# EAGLE design Estrella Neopixel PCBA (EAGLE 9.4.2)
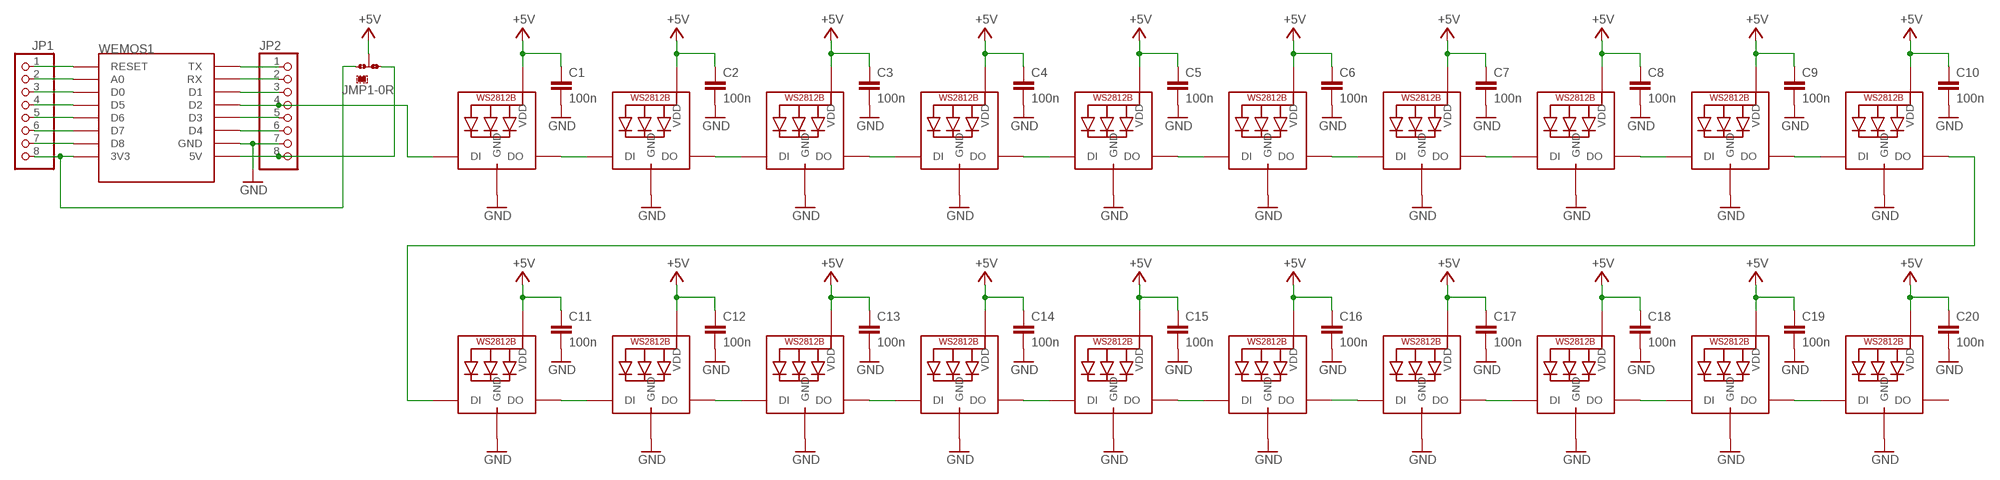
[diagram p0: schematic, sheet 1]

## Parts
C1  100n  C-EUC0805K  [C0805K]
C2  100n  C-EUC0805K  [C0805K]
C3  100n  C-EUC0805K  [C0805K]
C4  100n  C-EUC0805K  [C0805K]
C5  100n  C-EUC0805K  [C0805K]
C6  100n  C-EUC0805K  [C0805K]
C7  100n  C-EUC0805K  [C0805K]
C8  100n  C-EUC0805K  [C0805K]
C9  100n  C-EUC0805K  [C0805K]
C10  100n  C-EUC0805K  [C0805K]
C11  100n  C-EUC0805K  [C0805K]
C12  100n  C-EUC0805K  [C0805K]
C13  100n  C-EUC0805K  [C0805K]
C14  100n  C-EUC0805K  [C0805K]
C15  100n  C-EUC0805K  [C0805K]
C16  100n  C-EUC0805K  [C0805K]
C17  100n  C-EUC0805K  [C0805K]
C18  100n  C-EUC0805K  [C0805K]
C19  100n  C-EUC0805K  [C0805K]
C20  100n  C-EUC0805K  [C0805K]
JMP1  0R-JUMPA  [A0R-JMP]
JP1  PINHD-1X8  [1X08]
JP2  PINHD-1X8  [1X08]
LED1  WS2812B_5050N  [WS2812B-NARROW]
LED2  WS2812B_5050N  [WS2812B-NARROW]
LED3  WS2812B_5050N  [WS2812B-NARROW]
LED4  WS2812B_5050N  [WS2812B-NARROW]
LED5  WS2812B_5050N  [WS2812B-NARROW]
LED6  WS2812B_5050N  [WS2812B-NARROW]
LED7  WS2812B_5050N  [WS2812B-NARROW]
LED8  WS2812B_5050N  [WS2812B-NARROW]
LED9  WS2812B_5050N  [WS2812B-NARROW]
LED10  WS2812B_5050N  [WS2812B-NARROW]
LED11  WS2812B_5050N  [WS2812B-NARROW]
LED12  WS2812B_5050N  [WS2812B-NARROW]
LED13  WS2812B_5050N  [WS2812B-NARROW]
LED14  WS2812B_5050N  [WS2812B-NARROW]
LED15  WS2812B_5050N  [WS2812B-NARROW]
LED16  WS2812B_5050N  [WS2812B-NARROW]
LED17  WS2812B_5050N  [WS2812B-NARROW]
LED18  WS2812B_5050N  [WS2812B-NARROW]
LED19  WS2812B_5050N  [WS2812B-NARROW]
LED20  WS2812B_5050N  [WS2812B-NARROW]
WEMOS1  WEMOS-D1-MINI  [WEMOS-D1-MINI]

## Nets
+5V: C1.1 C2.1 C3.1 C4.1 C5.1 C6.1 C7.1 C8.1 C9.1 C10.1 C11.1 C12.1 C13.1 C14.1 C15.1 C16.1 C17.1 C18.1 C19.1 C20.1 JMP1.2 LED1.1-VDD(VDD) LED2.1-VDD(VDD) LED3.1-VDD(VDD) LED4.1-VDD(VDD) LED5.1-VDD(VDD) LED6.1-VDD(VDD) LED7.1-VDD(VDD) LED8.1-VDD(VDD) LED9.1-VDD(VDD) LED10.1-VDD(VDD) LED11.1-VDD(VDD) LED12.1-VDD(VDD) LED13.1-VDD(VDD) LED14.1-VDD(VDD) LED15.1-VDD(VDD) LED16.1-VDD(VDD) LED17.1-VDD(VDD) LED18.1-VDD(VDD) LED19.1-VDD(VDD) LED20.1-VDD(VDD)
GND: C1.2 C2.2 C3.2 C4.2 C5.2 C6.2 C7.2 C8.2 C9.2 C10.2 C11.2 C12.2 C13.2 C14.2 C15.2 C16.2 C17.2 C18.2 C19.2 C20.2 JP2.7 LED1.3-GND(GND) LED2.3-GND(GND) LED3.3-GND(GND) LED4.3-GND(GND) LED5.3-GND(GND) LED6.3-GND(GND) LED7.3-GND(GND) LED8.3-GND(GND) LED9.3-GND(GND) LED10.3-GND(GND) LED11.3-GND(GND) LED12.3-GND(GND) LED13.3-GND(GND) LED14.3-GND(GND) LED15.3-GND(GND) LED16.3-GND(GND) LED17.3-GND(GND) LED18.3-GND(GND) LED19.3-GND(GND) LED20.3-GND(GND) WEMOS1.GND
N$1: LED1.2-DOUT(DO) LED2.4-DIN(DI)
N$2: LED2.2-DOUT(DO) LED3.4-DIN(DI)
N$3: LED3.2-DOUT(DO) LED4.4-DIN(DI)
N$4: LED4.2-DOUT(DO) LED5.4-DIN(DI)
N$5: LED5.2-DOUT(DO) LED6.4-DIN(DI)
N$6: LED6.2-DOUT(DO) LED7.4-DIN(DI)
N$7: LED7.2-DOUT(DO) LED8.4-DIN(DI)
N$8: LED8.2-DOUT(DO) LED9.4-DIN(DI)
N$9: LED9.2-DOUT(DO) LED10.4-DIN(DI)
N$10: LED10.2-DOUT(DO) LED11.4-DIN(DI)
N$11: LED11.2-DOUT(DO) LED12.4-DIN(DI)
N$12: LED12.2-DOUT(DO) LED13.4-DIN(DI)
N$13: LED13.2-DOUT(DO) LED14.4-DIN(DI)
N$14: LED14.2-DOUT(DO) LED15.4-DIN(DI)
N$15: LED15.2-DOUT(DO) LED16.4-DIN(DI)
N$16: JMP1.3 JP2.8 WEMOS1.5V
N$17: JMP1.1 JP1.8 WEMOS1.3V3
N$18: JP1.1 WEMOS1.RESET
N$19: JP1.2 WEMOS1.A0
N$20: JP1.3 WEMOS1.D0
N$21: JP1.4 WEMOS1.D5
N$22: JP1.5 WEMOS1.D6
N$23: JP1.6 WEMOS1.D7
N$24: JP1.7 WEMOS1.D8
N$25: JP2.6 WEMOS1.D4
N$26: JP2.5 WEMOS1.D3
N$27: JP2.3 WEMOS1.D1
N$28: JP2.2 WEMOS1.RX
N$29: JP2.1 WEMOS1.TX
N$30: JP2.4 LED1.4-DIN(DI) WEMOS1.D2
N$31: LED17.2-DOUT(DO) LED18.4-DIN(DI)
N$32: LED18.2-DOUT(DO) LED19.4-DIN(DI)
N$33: LED19.2-DOUT(DO) LED20.4-DIN(DI)
N$34: LED16.2-DOUT(DO) LED17.4-DIN(DI)
Unconnected: LED20.2-DOUT(DO)

## Library data of the parts
C1-C20 = rcl:C-EU: CAPACITOR, European symbol; SPICEPREFIX: C
JMP1 = jump-0r-smd:0R-JUMP: SMD 0R 0805 Jumper
JP1 JP2 = pinhead:PINHD-1X8: PIN HEADER
LED1-LED20 = adafruit:WS2812B
WEMOS1 = esp8266modules:WEMOS-D1-MINI: WeMos.cc D1 mini ESP8266 module

## Board
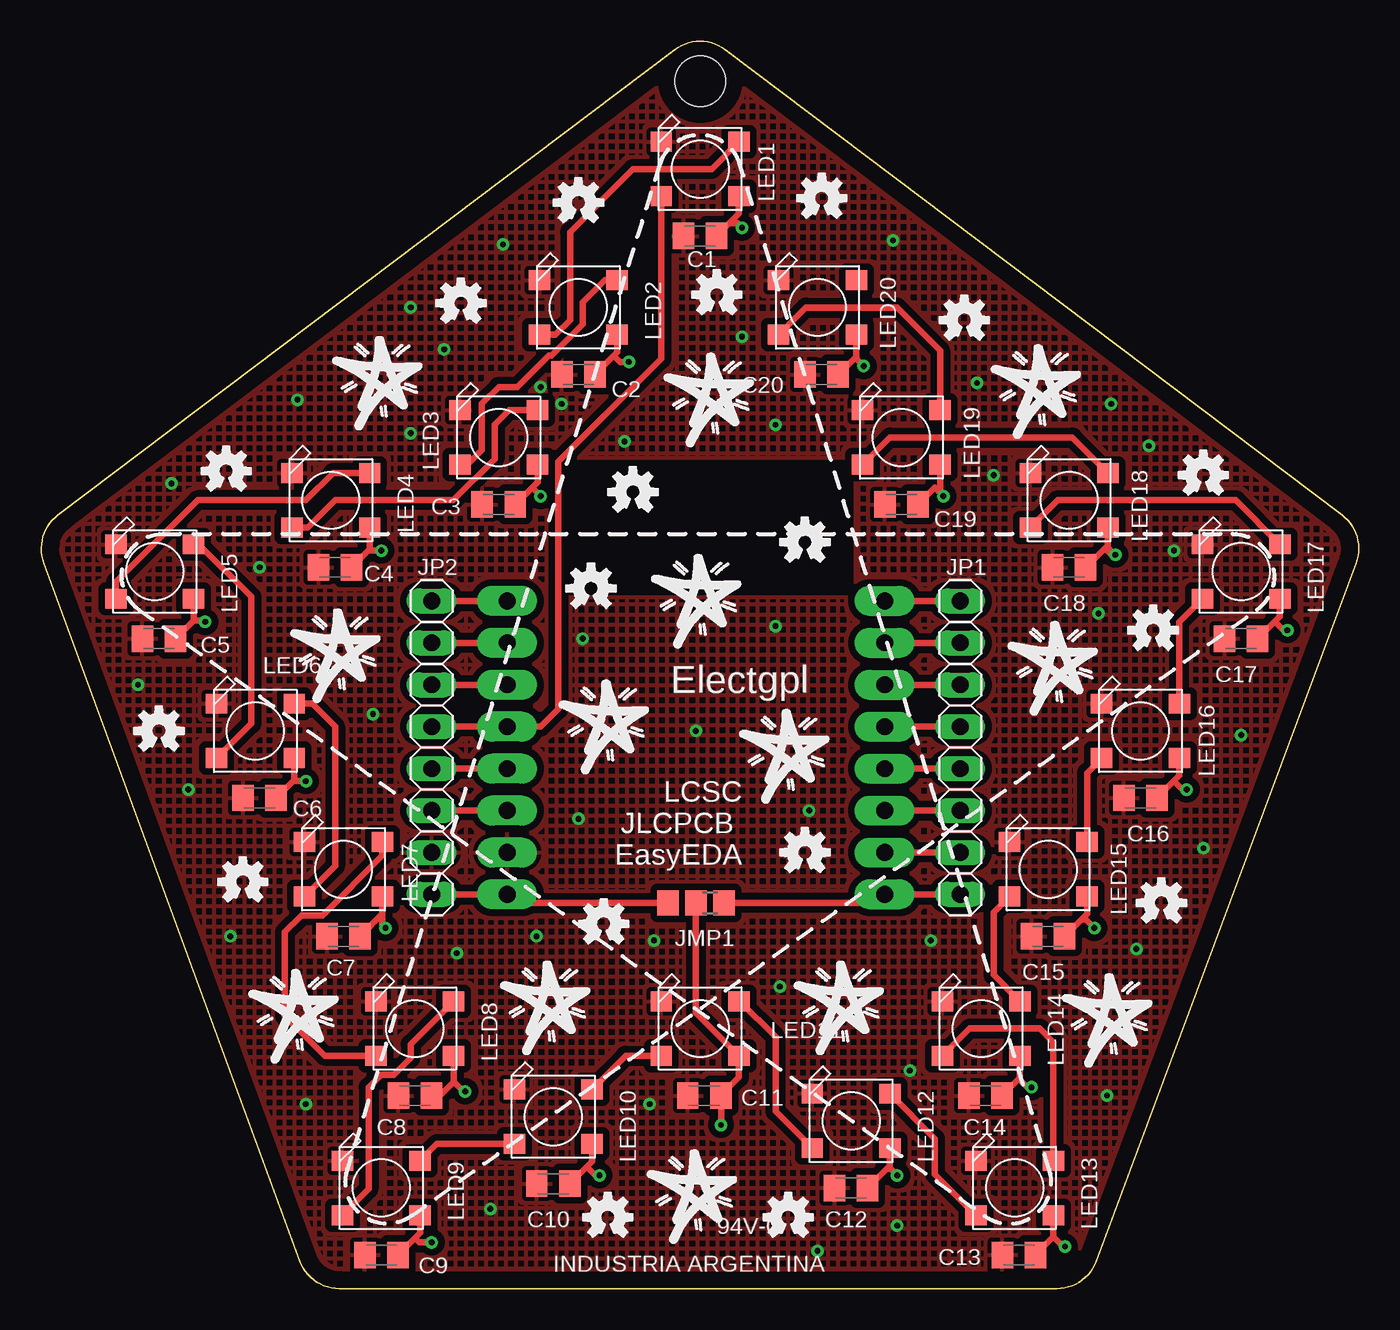
[diagram p1: board, top side]
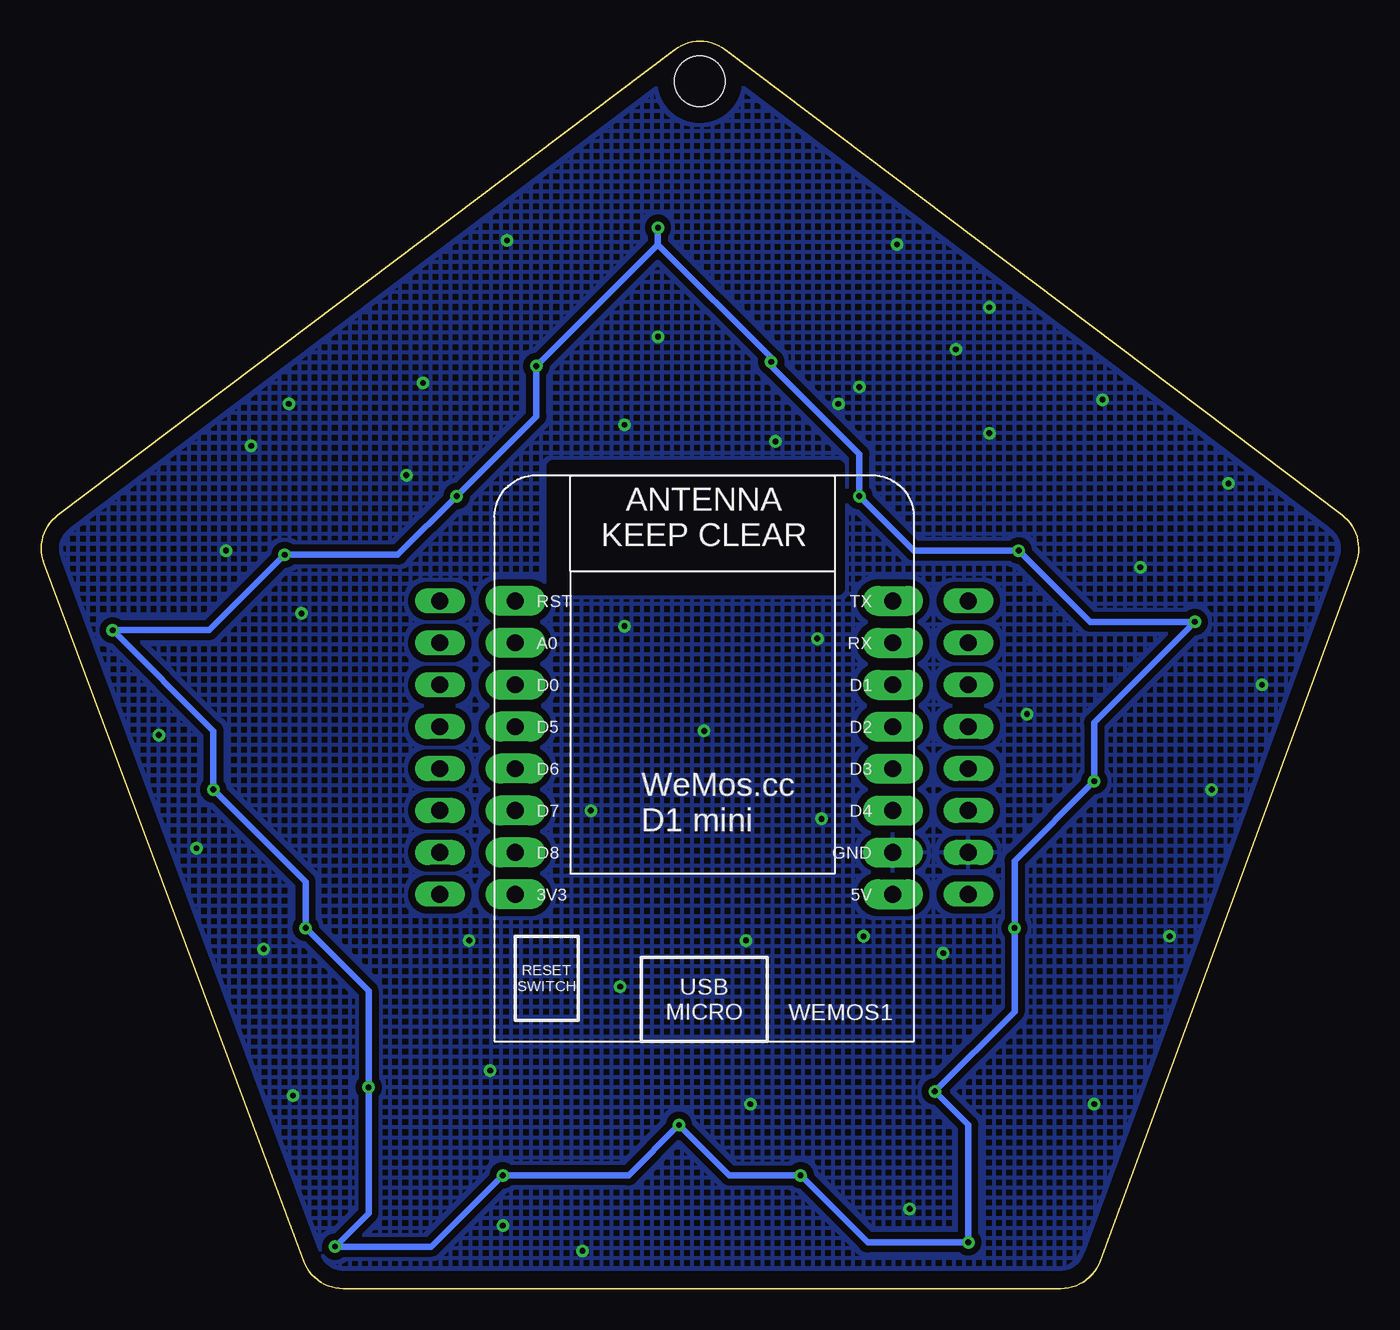
[diagram p2: board, bottom side, seen from below]

Size 79.78 x 75.56 mm. Coordinates in mm from the lower left corner, seen from the top.
Outline: 0.15,43.95 15.66,1.67 arc70 18.04,0 61.5,0 arc70 63.88,1.65 79.62,43.95 arc73 78.77,46.86 41.42,75.05 arc74 38.36,75.05 1.01,46.85 arc73 0.15,43.95
Copper layers (1*16): Top 0.035mm / dielectric 1.5mm / Bottom 0.035mm
Design rules "default": minimum track width 6mil, minimum drill 0.35mm, track to track 6mil, track to pad 6mil, pad to pad 6mil, via to via 6mil, smd to smd 6mil, copper to edge 40mil, drill to drill 6mil, minimum pad ring 10mil, minimum via ring 8mil, stop-mask expansion 4mil, vias tented up to drill 0mil, thermal gap 10mil
Holes 3.05 mm at 39.89,73.15
tRestrict: area 31.5,42.4 to 48.8,49.8
bRestrict: area 31.5,42.4 to 48.8,49.8

### Footprints (pad centres in the part's own frame; a part is rotated, then mirrored left to right if it is on the bottom)
C0805K = smd 1.3 x 1.6: 1 -1,0; 2 1,0
A0R-JMP = smd 1.5 x 1.3: 1 0,1.7; 2 0,0; 3 0,-1.7
1X08 = drill 1.016 long: 1 -8.89,0; 2 -6.35,0; 3 -3.81,0; 4 -1.27,0; 5 1.27,0; 6 3.81,0; 7 6.35,0; 8 8.89,0
WS2812B-NARROW = smd 1.3 x 1.2: 1-VDD 2.35,-1.65; 2-DOUT 2.35,1.65; 3-GND -2.35,1.65; 4-DIN -2.35,-1.65
WEMOS-D1-MINI = drill 1.016 pad 1.829 long: 3V3 -10.16,-10.16; 5V 12.7,-10.16; A0 -10.16,5.08; D0 -10.16,2.54; D1 12.7,2.54; D2 12.7,0; D3 12.7,-2.54; D4 12.7,-5.08; D5 -10.16,0; D6 -10.16,-2.54; D7 -10.16,-5.08; D8 -10.16,-7.62; GND 12.7,-7.62; RESET -10.16,7.62; RX 12.7,5.08; TX 12.7,7.62

### Placement (x,y rotation side)
C1  39.89,63.75 180 top
C2  32.53,55.37 180 top
C3  27.7,47.5 180 top
C4  17.79,43.69 180 top
C5  7.13,39.37 180 top
C6  13.22,29.72 180 top
C7  18.3,21.34 180 top
C8  22.62,11.68 180 top
C9  20.59,2.03 180 top
C10  31,6.35 180 top
C11  40.15,11.68 180 top
C12  49.04,6.1 180 top
C13  59.2,2.03 180 top
C14  57.16,11.68 180 top
C15  60.97,21.34 180 top
C16  66.56,29.72 180 top
C17  72.66,39.37 180 top
C18  62.24,43.69 180 top
C19  52.08,47.5 180 top
C20  47.26,55.37 180 top
JMP1  39.64,23.37 270 top
JP1  55.64,32.77 270 top
JP2  23.64,32.77 270 top
LED1  39.89,67.82 0 top
LED2  32.53,59.44 0 top
LED3  27.7,51.56 0 top
LED4  17.54,47.75 0 top
LED5  6.87,43.43 0 top
LED6  12.97,33.78 0 top
LED7  18.3,25.4 0 top
LED8  22.62,15.75 0 top
LED9  20.59,6.1 0 top
LED10  31,10.41 0 top
LED11  39.89,15.75 0 top
LED12  49.04,10.16 0 top
LED13  58.94,6.1 0 top
LED14  56.91,15.75 0 top
LED15  60.97,25.4 0 top
LED16  66.56,33.78 0 top
LED17  72.66,43.43 0 top
LED18  62.24,47.75 0 top
LED19  52.08,51.56 0 top
LED20  47,59.44 0 top
U$1  [STARBOARD_LOGO]  20.33,54.86 0 top
U$2  [STARBOARD_LOGO]  60.21,54.36 0 top
U$3  [STARBOARD_LOGO]  64.53,16.26 0 top
U$4  [STARBOARD_LOGO]  40.4,53.85 0 top
U$5  [STARBOARD_LOGO]  15.25,16.51 0 top
U$6  [STARBOARD_LOGO]  39.38,5.59 0 top
U$7  [STARBOARD_LOGO]  30.49,17.02 0 top
U$8  [STARBOARD_LOGO]  48.27,17.02 0 top
U$9  [STARBOARD_LOGO]  17.79,38.35 0 top
U$10  [STARBOARD_LOGO]  61.23,37.59 0 top
U$11  [OSHW-LOGO-S]  12.21,24.64 0 top
U$12  [OSHW-LOGO-S]  34.05,22.1 0 top
U$13  [STARBOARD_LOGO]  34.05,34.04 0 top
U$14  [STARBOARD_LOGO]  44.97,32.26 0 top
U$15  [STARBOARD_LOGO]  39.64,41.66 0 top
U$16  [OSHW-LOGO-S]  46.24,26.42 0 top
U$17  [OSHW-LOGO-S]  7.13,33.78 0 top
U$18  [OSHW-LOGO-S]  11.19,49.53 0 top
U$19  [OSHW-LOGO-S]  46.24,45.21 0 top
U$20  [OSHW-LOGO-S]  33.29,42.42 0 top
U$21  [OSHW-LOGO-S]  67.83,23.37 0 top
U$22  [OSHW-LOGO-S]  45.23,4.32 0 top
U$23  [OSHW-LOGO-S]  34.3,4.32 0 top
U$24  [OSHW-LOGO-S]  25.41,59.69 0 top
U$25  [OSHW-LOGO-S]  70.37,49.28 0 top
U$26  [OSHW-LOGO-S]  47.26,66.04 0 top
U$27  [OSHW-LOGO-S]  55.89,58.67 0 top
U$28  [OSHW-LOGO-S]  32.53,65.79 0 top
U$29  [OSHW-LOGO-S]  40.91,60.2 0 top
U$30  [OSHW-LOGO-S]  35.83,48.26 0 top
U$31  [OSHW-LOGO-S]  67.32,39.88 0 top
WEMOS1  40.91,34.04 0 bottom

### Tracks (layer width: path | path; a pad name or v marks a point on that pad's centre or on a via)
+5V  (via drill 0.35)
  Top 0.406: LED5.1-VDD 9.22,40.47 | C5.1 9.22,40.47 | LED6.1-VDD 15.32,30.81 | 15.32,30.81 C6.1 | LED3.1-VDD 30.05,48.85 29.72,48.52 | 29.72,48.52 C3.1 | LED2.1-VDD 34.88,56.72 34.68,56.52 | 34.68,56.52 C2.1 | LED20.1-VDD 49.35,56.47 | 49.35,56.47 C20.1 | C19.1 54.11,48.52 v54.62,48.01 54.43,48.2 LED19.1-VDD | C18.1 64.4,44.84 64.78,44.45 v65.04,44.45 64.59,44.89 LED18.1-VDD | LED17.1-VDD 75.01,40.72 74.68,40.39 | 74.68,40.39 C17.1 | LED16.1-VDD 68.91,31.07 68.59,30.74 | 68.59,30.74 C16.1 | LED15.1-VDD 63.32,22.69 63,22.36 | 63,22.36 C15.1 | LED14.1-VDD 59.26,12.78 59.19,12.71 | 59.19,12.71 C14.1 | LED13.1-VDD 61.29,3.13 | 61.29,3.13 C13.1 | LED12.1-VDD 51.39,7.45 51.19,7.25 | 51.19,7.25 C12.1 | LED10.1-VDD 33.35,7.7 33.03,7.37 | 33.03,7.37 C10.1 | LED9.1-VDD 22.94,3.38 22.61,3.06 | 22.61,3.06 C9.1 | LED8.1-VDD 24.97,12.51 | 24.97,12.51 23.64,11.18 23.62,11.19 C8.1 | C7.1 20.65,22.69 LED7.1-VDD 20.65,22.03 v20.84,21.84 | v25.67,11.94 25.54,11.94 24.97,12.51 | 22.61,3.06 22.87,2.79 v23.64,2.79 | v33.8,6.86 33.54,6.86 33.03,7.37 | v41.16,9.91 41.16,11.67 C11.1 42.24,12.78 LED11.1-VDD 39.64,16.7 JMP1.2 | v51.83,6.86 51.44,7.25 51.19,7.25 | 61.29,3.13 61.88,2.54 v61.99,2.54 | v59.96,12.19 59.7,12.19 59.19,12.71 | 63,22.36 63.25,22.36 v63.77,21.84 | v69.36,30.23 69.1,30.23 68.59,30.74 | 74.68,40.39 75.2,39.88 v75.45,39.88 | v49.8,55.88 49.35,56.32 49.35,56.47 | LED1.1-VDD 42.24,65.1 41.66,64.52 | 41.66,64.52 C1.1 | 41.66,64.52 42.17,64.52 v42.43,64.26 | v35.57,56.13 35.07,56.13 34.68,56.52 | 29.72,48.52 v30.24,48.01 | v20.59,44.7 19.97,44.7 19.89,44.78 | 9.22,40.47 9.84,40.47 v9.92,40.39 | v16.02,30.73 15.4,30.73 15.32,30.81 | LED4.1-VDD 19.89,44.78
  Top 0.406: 19.89,44.78 C4.1
  Bottom 0.406: 42.43,63.25 v49.8,55.88 49.8,52.83 v54.62,48.01 58.18,44.45 v65.04,44.45 69.61,39.88 v75.45,39.88 69.36,33.78 v69.36,30.23 63.77,24.64 v63.77,21.84 59.96,18.03 v59.96,12.19 59.96,4.57 v61.99,2.54 56.15,2.54 v51.83,6.86 44.21,6.86 v41.16,9.91 38.11,6.86 v33.8,6.86 29.73,2.79 v23.64,2.79 23.64,9.91 v25.67,11.94 20.84,16.76 v20.84,21.84 20.84,25.91 v16.02,30.73 16.02,34.29 v9.92,40.39 16.27,40.39 v20.59,44.7 26.94,44.7 v30.24,48.01 30.24,50.55 35.57,55.88 v35.57,56.13 35.57,56.39 42.43,63.25 | v42.43,64.26 42.43,63.25
GND  (via drill 0.35)
  other vias: 27.95,63.25 22.37,59.44 24.4,56.9 15.51,53.85 22.37,51.82 7.89,48.77 13.22,43.69 5.86,36.58 20.08,34.8 42.43,57.66 44.46,52.32 35.32,51.31 51.58,63.5 56.66,54.86 64.78,53.59 67.07,51.05 68.59,44.7 64.02,40.89 57.67,49.28 72.66,33.53 70.37,26.67 66.31,20.57 64.53,11.68 53.86,21.08 52.59,13.21 36.84,11.18 27.19,4.83 16.02,11.18 11.44,21.34 8.9,30.23 25.16,20.32 51.83,3.81 47,2.29 29.99,21.34 37.1,21.08 44.72,18.29 32.53,28.45 39.64,33.78 44.46,40.13 32.78,39.37 46.5,28.96 31.51,53.59 30.24,54.61
  pour Top (isolate 0.406, hatched): -2.78,47.75 39.38,79.25 85.1,44.7 64.28,-11.68 12.97,-10.16 -3.03,47.75
  pour Bottom (isolate 0.406, hatched): -4.56,44.96 9.41,-2.79 72.66,-3.3 87.64,43.69 91.2,51.05 61.23,74.68 38.37,80.77
N$1
  Top 0.406: LED1.2-DOUT 40.59,67.82 35.83,67.82 32.02,64.01 32.02,58.67 31.13,57.79 LED2.4-DIN
N$2
  Top 0.406: LED2.2-DOUT 34.11,61.09 32.78,59.75 32.78,58.42 30.89,56.53 30.73,56.53 28.81,54.61 27.7,54.61 26.68,53.59 26.68,50.8 25.8,49.91 LED3.4-DIN
N$3
  Top 0.406: LED3.2-DOUT 28.33,53.21 27.45,52.32 27.45,50.26 24.94,47.75 17.79,47.75 16.14,46.1 LED4.4-DIN
N$4
  Top 0.406: LED4.2-DOUT 17.67,49.4 16.02,47.75 9.47,47.75 4.52,42.8 LED5.4-DIN
N$5
  Top 0.406: LED5.2-DOUT 9.54,45.08 12.71,41.91 12.71,34.23 LED6.4-DIN
N$6
  Top 0.406: LED6.2-DOUT 16.4,35.43 17.79,34.04 17.79,25.59 LED7.4-DIN
N$7
  Top 0.406: LED7.2-DOUT 20.65,26.23 17.03,22.61 15.76,22.61 14.75,21.59 14.75,16.51 17.16,14.1 LED8.4-DIN
N$8
  Top 0.406: LED8.2-DOUT 22.37,14.79 22.37,13.97 21.35,12.95 20.59,12.95 19.83,12.19 19.83,6.03 LED9.4-DIN
N$9
  Top 0.406: LED9.2-DOUT 23.96,8.76 LED10.4-DIN
N$10
  Top 0.406: LED10.2-DOUT 35.39,14.1 LED11.4-DIN
N$11
  Top 0.406: LED11.2-DOUT 42.31,17.4 44.46,15.24 44.46,10.73 LED12.4-DIN
N$12
  Top 0.406: LED12.2-DOUT 54.12,9.08 54.12,6.92 LED13.4-DIN
N$13
  Top 0.406: LED14.4-DIN 56.21,15.75 60.47,15.75 61.29,14.92 LED13.2-DOUT
N$14
  Top 0.406: LED14.2-DOUT 57.67,18.99 57.67,22.8 LED15.4-DIN
N$15
  Top 0.406: LED15.2-DOUT 63.32,31.24 LED16.4-DIN
N$16
  Top 0.406: JMP1.3 28.72,23.37 WEMOS1.5V JP2.8
N$17
  Top 0.406: JMP1.1 50.56,23.37 WEMOS1.3V3 JP1.8
N$18
  Top 0.406: WEMOS1.RESET JP1.1
N$19
  Top 0.406: WEMOS1.A0 JP1.2
N$20
  Top 0.406: JP1.3 WEMOS1.D0
N$21
  Top 0.406: WEMOS1.D5 JP1.4
N$22
  Top 0.406: JP1.5 WEMOS1.D6
N$23
  Top 0.406: WEMOS1.D7 JP1.6
N$24
  Top 0.406: JP1.7 WEMOS1.D8
N$25
  Top 0.406: WEMOS1.D4 JP2.6
N$26
  Top 0.406: JP2.5 WEMOS1.D3
N$27
  Top 0.406: JP2.3 WEMOS1.D1
N$28
  Top 0.406: WEMOS1.RX JP2.2
N$29
  Top 0.406: JP2.1 WEMOS1.TX
N$30
  Top 0.406: JP2.4 WEMOS1.D2 30.24,34.04 31.31,35.1 31.31,50.09 37.54,56.32 LED1.4-DIN 37.61,66.1
N$31
  Top 0.406: LED18.4-DIN 61.54,47.75 72.34,47.75 LED17.2-DOUT
N$32
  Top 0.406: LED19.4-DIN 51.38,51.56 62.43,51.56 LED18.2-DOUT
N$33
  Top 0.406: LED20.4-DIN 46.3,59.44 51.83,59.44 54.43,56.83 LED19.2-DOUT
N$34
  Top 0.406: LED16.2-DOUT 68.91,40.39 LED17.4-DIN

### Text on the board
tNames: Electgpl | LCSC / JLCPCB / EasyEDA | 94V-0 | INDUSTRIA ARGENTINA